# Altium schematic sheet EFR32xG22_LC_REF_DES_A02_TP_Connectors.SchDoc
size 420 x 297 mm
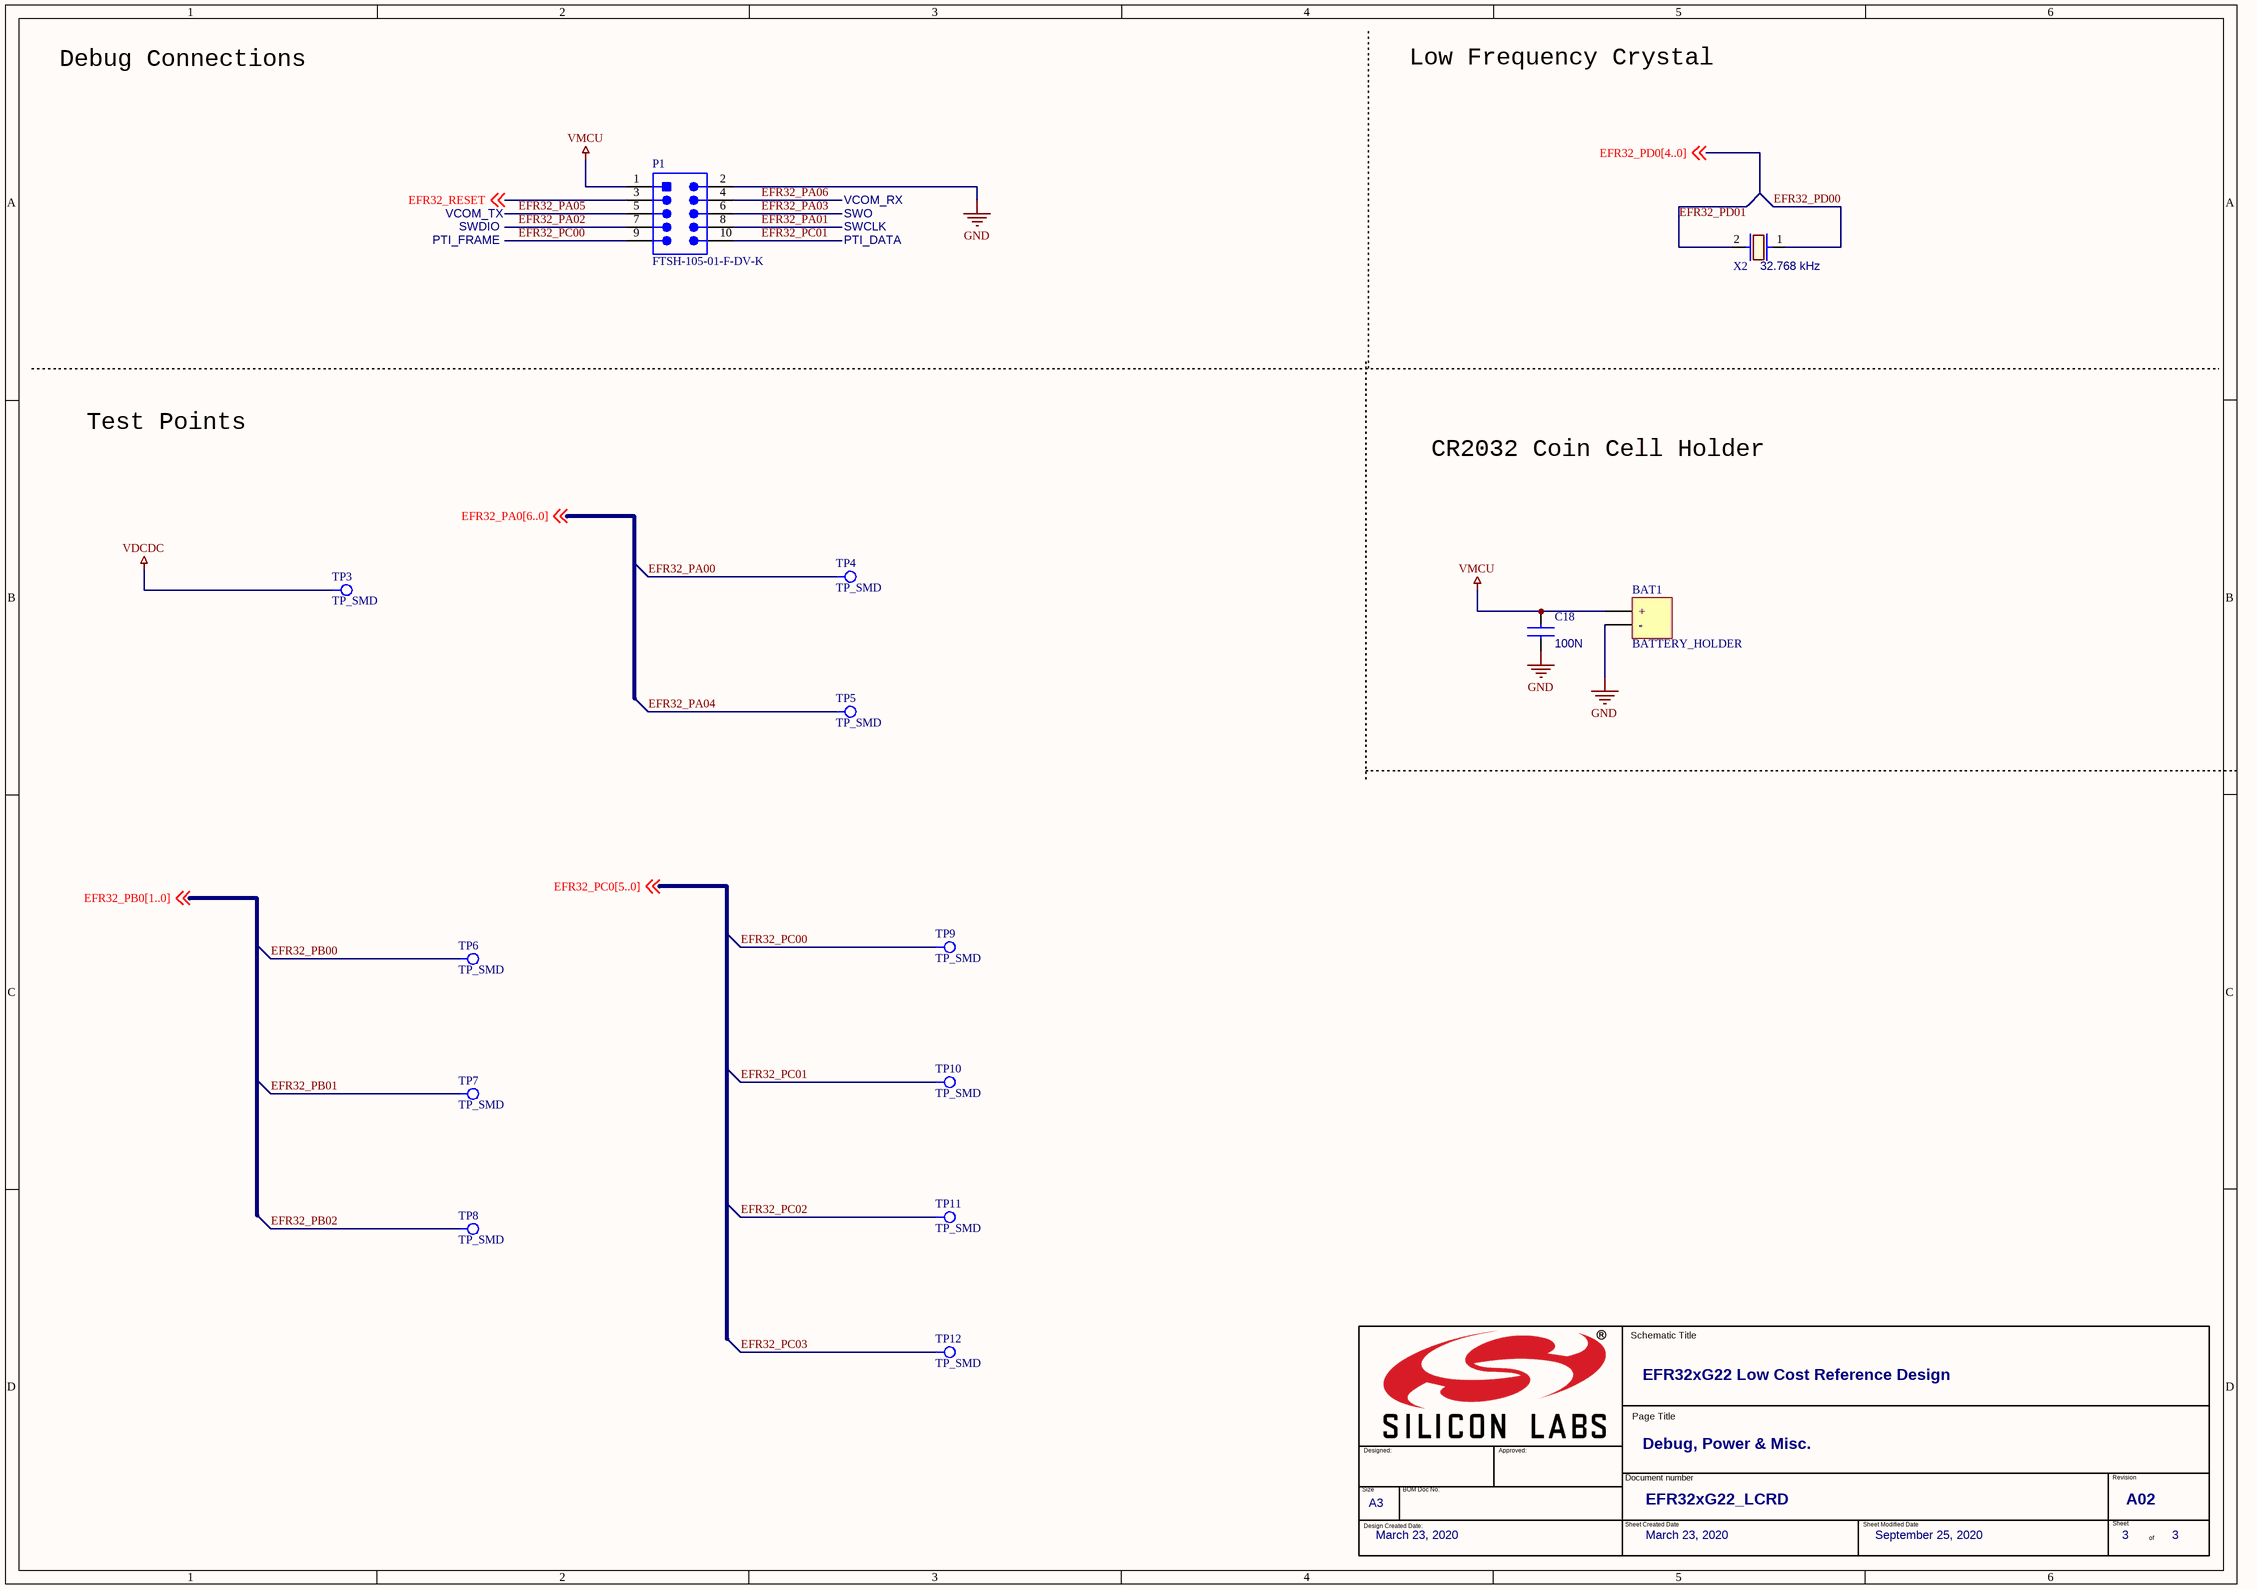
[diagram p0: EFR32xG22_LC_REF_DES_A02_TP_Connectors.SchDoc]

## Parts
*?  Page Title: Debug, Power & Misc.  Page Size: A3  Title: EFR32xG22 Low Cost Reference Design  Page Number: 3  (hidden comment: TitleBlock_EnergyMicro_A3)  (graphical)
BAT1  BATTERY_HOLDER
C18  100N  [C_0402]
P1  FTSH-105-01-F-DV-K  [SMTC-FTSH-105-01-L-DV-K_V]
TP3  TP_SMD  [TP]
TP4  TP_SMD  [TP]
TP5  TP_SMD  [TP]
TP6  TP_SMD  [TP]
TP7  TP_SMD  [TP]
TP8  TP_SMD  [TP]
TP9  TP_SMD  [TP]
TP10  TP_SMD  [TP]
TP11  TP_SMD  [TP]
TP12  TP_SMD  [TP]
X2  32.768 kHz  [LFXO]

## Nets
GND: BAT1.2(-) C18.2 P1.2
VDCDC: TP3.1(TP)
VMCU: BAT1.1(+) C18.1 P1.1
EFR32_PA00: TP4.1(TP)
EFR32_PA01: P1.8
EFR32_PA02: P1.7
EFR32_PA03: P1.6
EFR32_PA04: TP5.1(TP)
EFR32_PA05: P1.5
EFR32_PA06: P1.4
EFR32_PB00: TP6.1(TP)
EFR32_PB01: TP7.1(TP)
EFR32_PB02: TP8.1(TP)
EFR32_PC00: P1.9 TP9.1(TP)
EFR32_PC01: P1.10 TP10.1(TP)
EFR32_PC02: TP11.1(TP)
EFR32_PC03: TP12.1(TP)
EFR32_PD00: X2.1
EFR32_PD01: X2.2
EFR32_RESET: P1.3 ; off-sheet EFR32_RESET

## Notes on the sheet
- Debug Connections
- Low Frequency Crystal
- PTI_FRAME
- VCOM_TX
- SWDIO
- VCOM_RX
- SWO
- SWCLK
- PTI_DATA
- Test Points
- CR2032 Coin Cell Holder
- March 23, 2020
- EFR32xG22_LCRD
- September 25, 2020
- A02
- (in symbol TitleBlock_EnergyMicro_A3) Schematic Title; Page Title; Designed:; Approved:; Document number; Revision; Size; BOM Doc No:; Design Created Date:; Sheet Created Date; Sheet Modified Date; Sheet; of

## Library data of the parts
*? = TitleBlock_EnergyMicro_A3: OrgName: Silicon Labs; Page Count: 3
C18 = C0201
P1 = CMP-2000-05352-1: Male Header, Pitch 1.27 mm, 2 x 5 Position, Height 6.12 mm, RoHS, Tube; Manufacturer: Samtec; Number of Positions: 10; Connector Type: Header,Shrouded; Number of Positions Loaded: All; Row Spacing: 0.050"(1.27mm); Fastening Type: -; Package Reference: FTSH-105-01-L-DV-K; Termination: Solder; Package URL: http://suddendocs.samtec.com/prints/ftsh-1xx-xx-xxx-dv-xxx-footprint.pdf; Number of Rows: 2; Contact Finish Thickness: 3µin(0.08µm); Contact Type: MalePin; Manufacturer URL: http://www.samtec.com/; Contact Mating Length: 0.120"(3.05mm); Pitch: 0.050"(1.27mm); Series: FTSH; Features: -; Contact Finish: Gold; Color: Black; Family: RectangularConnectors-Headers,MalePins; Datasheet URL: http://suddendocs.samtec.com/prints/ftsh-1xx-xx-xxx-dv-xxx-mkt.pdf; Package Description: Male Header, Pitch 1.27 mm, 2 x 5 Position, Height 5.97 mm, Tail Length 4.32 mm; Mounting Type: SurfaceMount; Datasheet Version: Rev. ET, 10/1995; Category: Connectors,Interconnects; Packaging: Tube
X2 = LFXO: Mfg #: CM8V-T1A, 32768Hz, 12.5pF, +/- 20ppm; Mfg: Micro Crystal AG; Price_1K: 0.3